# Altium schematic sheet 海关全向控制器USB转接板V4.SchDoc
size A4
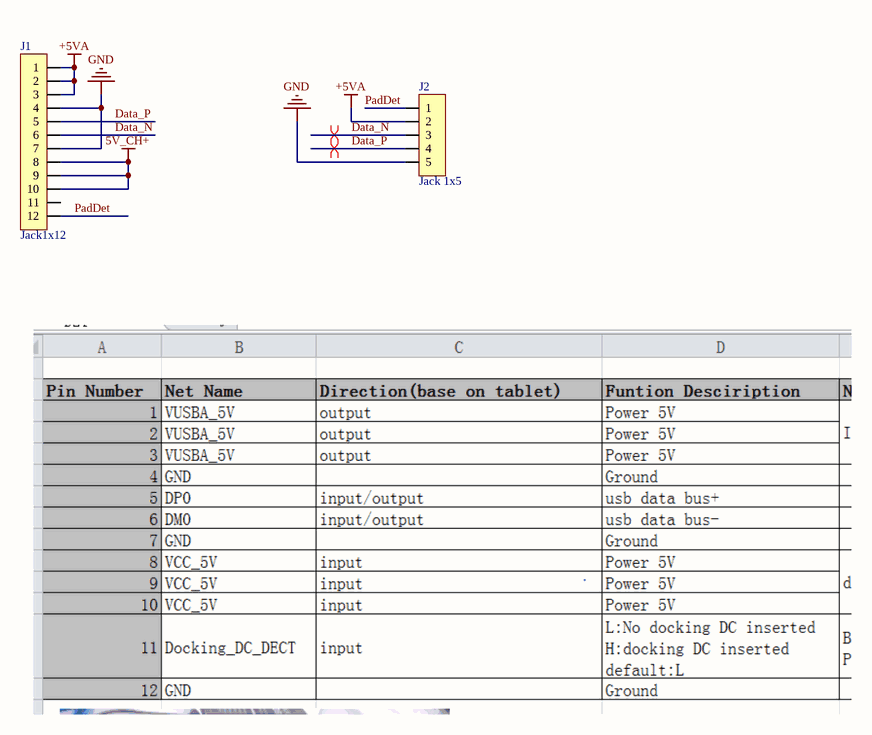
[diagram p0: 海关全向控制器USB转接板V4.SchDoc]

## Parts
J1  Jack1x12  [PPM.12-711-0102]
J2  Jack 1x5  [35363-0560]

## Nets
5V_CH+: J1.8 J1.9 J1.10
+5VA: J1.1 J1.2 J1.3 J2.2
GND: J1.4 J1.7 J2.5
Data_N: J1.6 J2.3
Data_P: J1.5 J2.4
PadDet: J1.12 J2.1

Not connected (* = marked no-connect by the designer): J1 11

## Layout directives
differential pair: Data_N, Data_P

## Notes on the sheet
- 文件名:
- 审核:
- 制图人:
- 孟浩
- 校对:
- 图号:
- 批准:
- 日期:

## Library data of the parts
J1 = Jack1x12: 插座
J2 = Jack 1x5: 插座